# EAGLE design MainBoard (EAGLE 9.3.0)
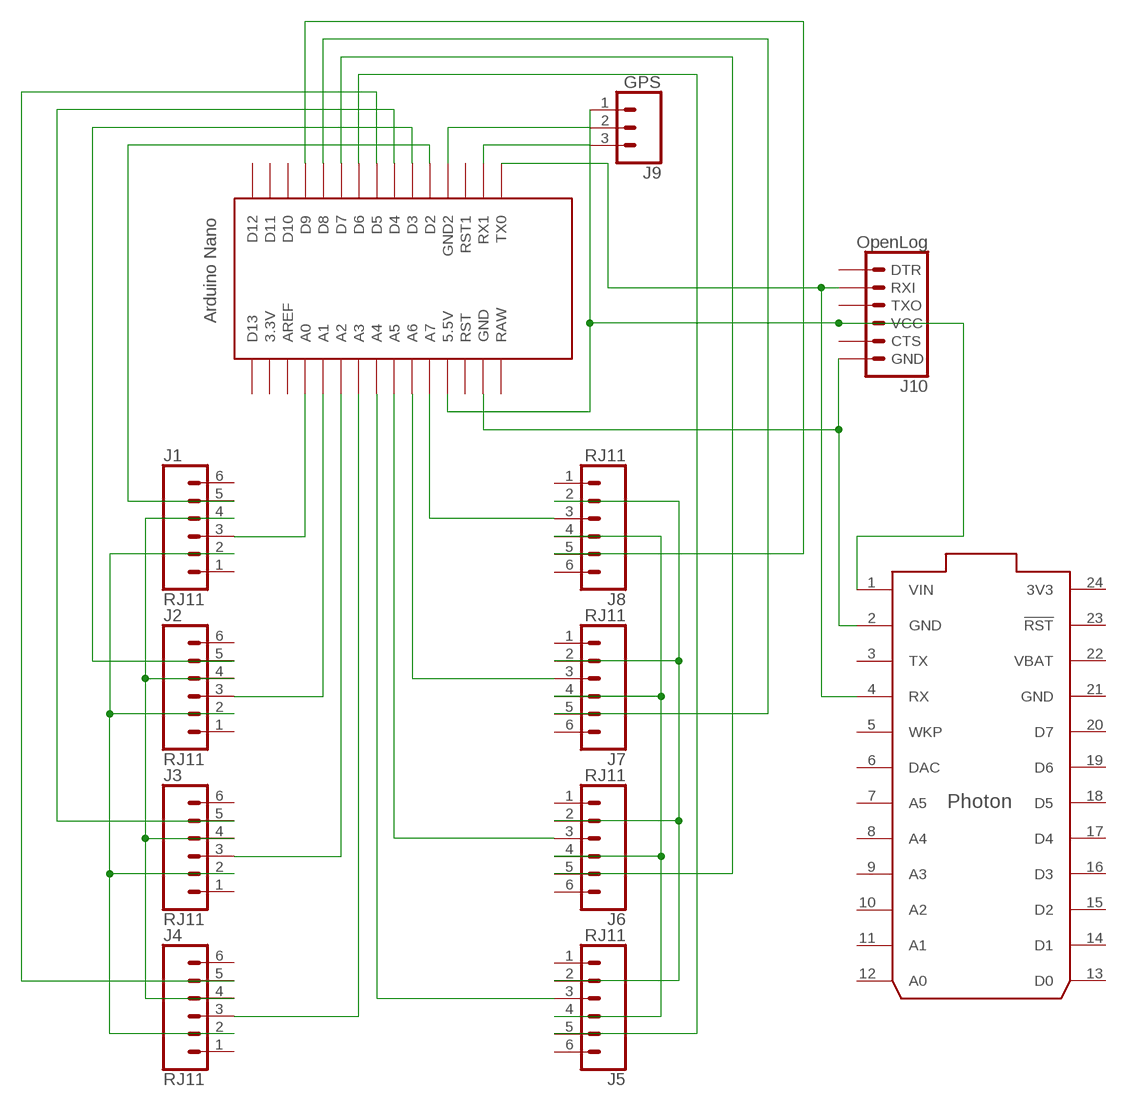
[diagram p0: schematic, sheet 1]

## Parts
J1  RJ11  RJ11-6  [RJ11-6]
J2  RJ11  RJ11-6  [RJ11-6]
J3  RJ11  RJ11-6  [RJ11-6]
J4  RJ11  RJ11-6  [RJ11-6]
J5  RJ11  RJ11-6  [RJ11-6]
J6  RJ11  RJ11-6  [RJ11-6]
J7  RJ11  RJ11-6  [RJ11-6]
J8  RJ11  RJ11-6  [RJ11-6]
J9  GPS  CONN_03  [1X03]
J10  OpenLog  6_PIN_SERIAL_TARGET  [1X06]
U$1  NANO  [NANO]
U$2  PHOTON_WITH_HEADERS  [PHOTON]

## Nets
N$1: J1.2 J2.2 J3.2 J4.2
N$2: J1.3 U$1.A0
N$3: J2.3 U$1.A1
N$4: J5.2 J6.2 J7.2 J8.2
N$5: J1.4 J2.4 J3.4 J4.4
N$6: J5.4 J6.4 J7.4 J8.4
N$7: J3.3 U$1.A2
N$8: J4.3 U$1.A3
N$9: J5.3 U$1.A4
N$10: J6.3 U$1.A5
N$11: J7.3 U$1.A6
N$12: J8.3 U$1.A7
N$13: J1.5 U$1.D2
N$14: J2.5 U$1.D3
N$15: J3.5 U$1.D4
N$16: J4.5 U$1.D5
N$17: J5.5 U$1.D6
N$18: J6.5 U$1.D7
N$19: J7.5 U$1.D8
N$20: J8.5 U$1.D9
N$21: J9.3 U$1.RX1
N$22: J9.2 U$1.GND1(GND2)
N$23: J9.1 J10.4(VCC) U$1.5V(5.5V) U$2.1(VIN)
N$24: J10.6(GND) U$1.GND U$2.2(GND)
N$25: J10.2(RXI) U$1.TX0 U$2.4(RX)
Unconnected: J1.1 J1.6 J2.1 J2.6 J3.1 J3.6 J4.1 J4.6 J5.1 J5.6 J6.1 J6.6 J7.1 J7.6 J8.1 J8.6 J10.1(DTR) J10.3(TXO) J10.5(CTS) U$1.3.3V U$1.AREF U$1.D10 U$1.D11 U$1.D12 U$1.D13 U$1.ICSP1 U$1.ICSP2 U$1.ICSP3 U$1.ICSP4 U$1.ICSP5 U$1.ICSP6 U$1.RAW U$1.RST U$1.RST1 U$2.3(TX) U$2.5(WKP) U$2.6(DAC) U$2.7(A5) U$2.8(A4) U$2.9(A3) U$2.10(A2) U$2.11(A1) U$2.12(A0) U$2.13(D0) U$2.14(D1) U$2.15(D2) U$2.16(D3) U$2.17(D4) U$2.18(D5) U$2.19(D6) U$2.20(D7) U$2.23(!RST)

## Power pins joined to a net without a drawn wire
3V3: U$2.24(3V3)
GND: U$2.21(GND)
VBAT: U$2.22(VBAT)

## Library data of the parts
J1-J8 = SparkFun-Connectors:RJ11-6: RJ11 Jack - 6 pin Commonly found on CAT3 devices and some Microchip programmers. Here is the connector we sell at SparkFun: RJ11 6-Pin Connector <https://www.sparkfun.com/products/132> (PRT-00132) Datasheet <http://www.sparkfun.com/datasheets/Prototyping/Connectors/RJ11-Datasheet.pdf> It is used on this SparkFun product: SparkFun Weather Shield <https://www.sparkfun.com/products/12081> (DEV-12081) Weather Meters <https://www.sparkfun.com/products/8942> (SEN-08942); PROD_ID: CONN-08590; SF_ID: PRT-00132
J9 = SparkFun-Connectors:CONN_03: Multi connection point. Often used as Generic Header-pin footprint for 0.1 inch spaced/style header connections On any of the 0.1 inch spaced packages, you can populate with these: Break Away Headers - Straight <https://www.sparkfun.com/products/116> (PRT-00116) Break Away Male Headers - Right Angle <https://www.sparkfun.com/products/553> (PRT-00553) Female Headers <https://www.sparkfun.com/products/115> (PRT-00115) Break Away Headers - Machine Pin <https://www.sparkfun.com/products/117> (PRT-00117) Break Away Female Headers - Swiss Machine Pin <https://www.sparkfun.com/products/743> (PRT-00743) Stackable Header - 3 Pin (Female, 0.1") <https://www.sparkfun.com/products/13875> (PRT-13875) For SCREWTERMINALS and SPRING TERMINALS visit here: Screw Terimnals on SparkFun.com <https://www.sparkfun.com/search/results?term=Screw+Terminals> (5mm/3.5mm/2.54mm spacing) This device is also useful as a general connection point to wire up your design to another part of your project. Our various solder wires solder well into these plated through hole pads. Hook-Up Wire - Assortment (Stranded, 22 AWG) <https://www.sparkfun.com/products/11375> (PRT-11375) Hook-Up Wire - Assortment (Solid Core, 22 AWG) <https://www.sparkfun.com/products/11367> (PRT-11367) View the entire wire category on our website here <https://www.sparkfun.com/categories/141> Special notes: Molex polarized connector foot print use with SKU : PRT-08232 with associated crimp pins and housings.
J10 = SparkFun-Connectors:6_PIN_SERIAL_TARGET: 6-pin header connection for use with the "FTDI BASIC" pinout - TARGET SIDE. Also known as "Arduino Serial Program Header". It is used to mate with our FTDI Basic serial programmers using the Arduino IDE. Note, this device has "TARGET" in the name. It is intended to be used on a design that contains a target micro-controller that you wish to program. The "sister" device, named "CABLE" is inteneded to be used on a design that usually lives on the end of your USB cable and prvides the converter chip (FTDI232 or FTDI231x) to commnicate serial RX/TX. You can populate with some of these: Break Away Headers - Straight <https://www.sparkfun.com/products/116> (PRT-00116) For reference (or to suit your programming needs) check out these designs: SparkFun FTDI Basic Breakout - 5V <https://www.sparkfun.com/products/9716> (DEV-09716) SparkFun FTDI Basic Breakout - 3.3V <https://www.sparkfun.com/products/9873> (DEV-09873) SparkFun FTDI SmartBasic <https://www.sparkfun.com/products/12935> (DEV-12935) SparkFun Beefy 3 - FTDI Basic Breakout <https://www.sparkfun.com/products/13746> (DEV-13746)
U$1 = Arduino-clone:NANO: Arduino Nano
U$2 = Particle-Devices:PHOTON: Particle Photon Wi-Fi through-hole development board footprint Product datasheet: here <https://docs.particle.io/datasheets/photon-(wifi)/photon-datasheet/> Design files: here <https://github.com/particle-iot/photon> Github : Particle devices library <https://github.com/particle-iot/hardware-libraries/tree/master/Eagle>

## Board
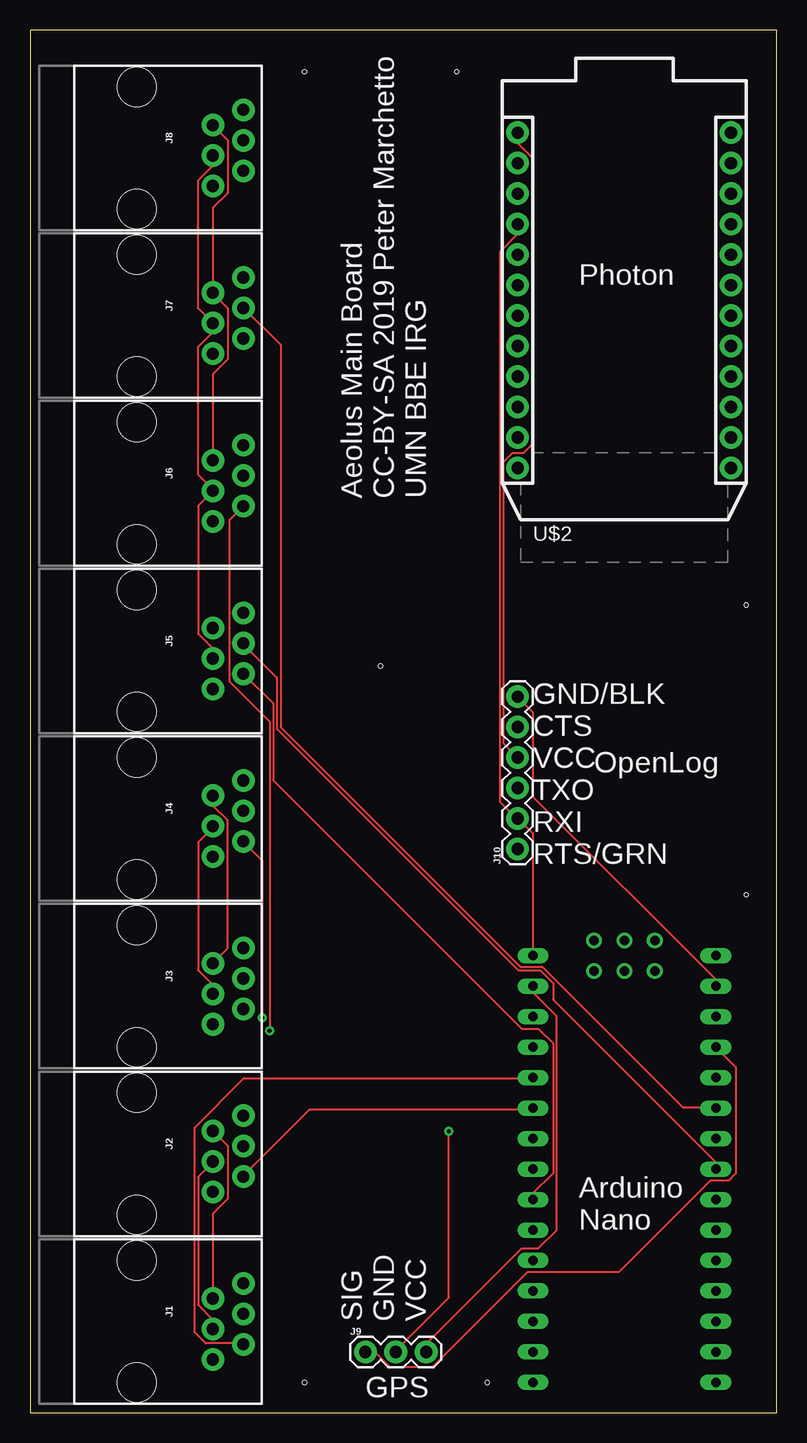
[diagram p1: board, top side]
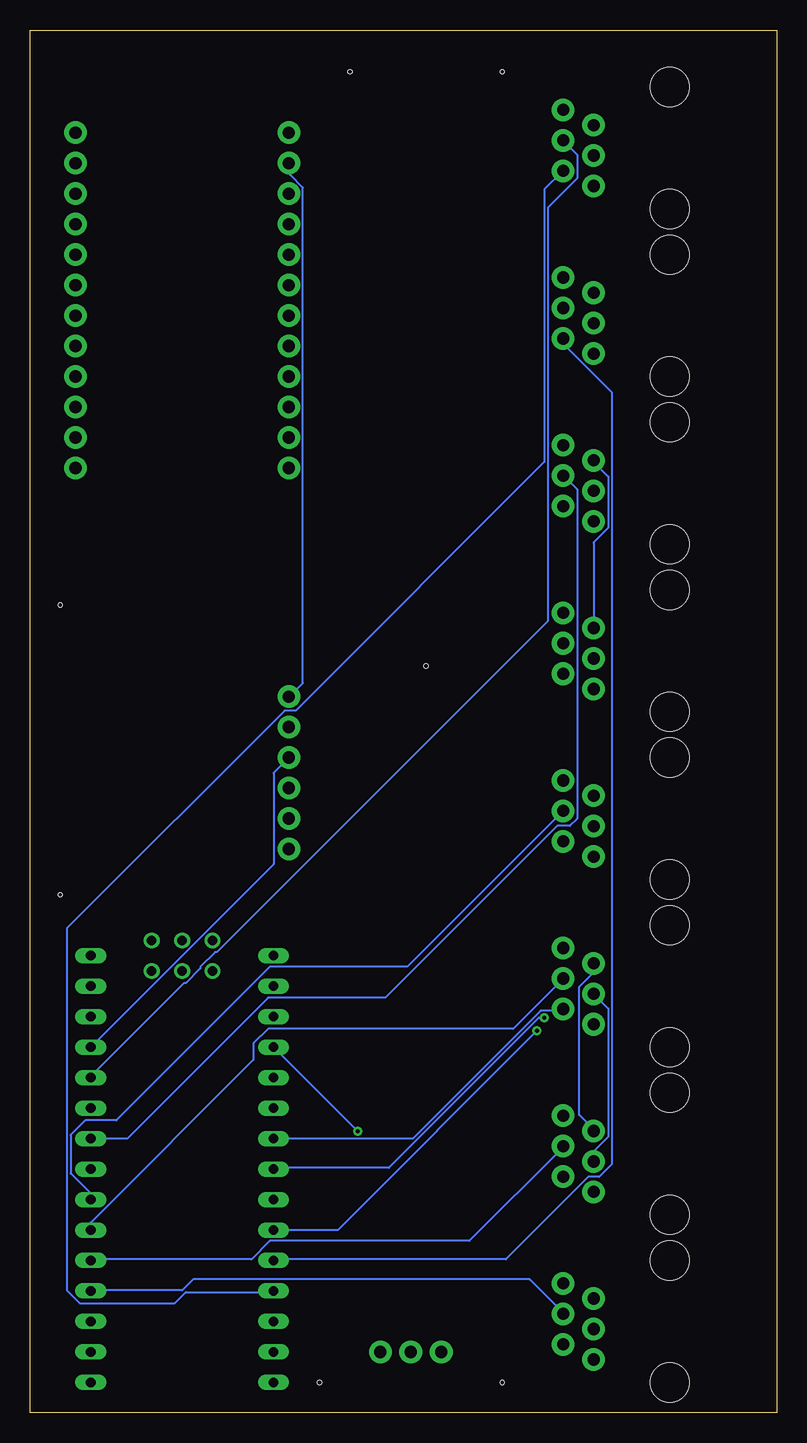
[diagram p2: board, bottom side, seen from below]

Size 62.21 x 115.24 mm. Coordinates in mm from the lower left corner, seen from the top.
Outline: 0,0 62.21,0 62.21,115.24 0,115.24 0,0
Copper layers (1*16): Top 0.035mm / dielectric 1.5mm / Bottom 0.035mm
Design rules "default": minimum track width 6mil, minimum drill 0.35mm, track to track 6mil, track to pad 6mil, pad to pad 6mil, via to via 6mil, smd to smd 6mil, copper to edge 40mil, drill to drill 6mil, minimum pad ring 10mil, minimum via ring 8mil, stop-mask expansion 4mil, vias tented up to drill 0mil, thermal gap 10mil
Holes 0.35 mm at 22.86,2.54 38.1,2.54 59.69,67.31 59.69,43.18 22.86,111.76 35.56,111.76 29.21,62.23

### Footprints (pad centres in the part's own frame; a part is rotated, then mirrored left to right if it is on the bottom)
RJ11-6 = drill 1.016 pad 1.88: 1 -3.175,8.89; 2 -1.905,6.35; 3 -0.635,8.89; 4 0.635,6.35; 5 1.905,8.89; 6 3.175,6.35 | hole 3.251: -5.08,0; 5.08,0
1X03 = drill 1.016 pad 1.88: 1 0,0; 2 2.54,0; 3 5.08,0
1X06 = drill 1.016 pad 1.88: 1 0,0; 2 2.54,0; 3 5.08,0; 4 7.62,0; 5 10.16,0; 6 12.7,0
NANO = drill 0.8 long: 3.3V -10.16,24.13; 5V -10.16,-1.27; A0 -10.16,19.05; A1 -10.16,16.51; A2 -10.16,13.97; A3 -10.16,11.43; A4 -10.16,8.89; A5 -10.16,6.35; A6 -10.16,3.81; A7 -10.16,1.27; AREF -10.16,21.59; D2 5.08,1.27; D3 5.08,3.81; D4 5.08,6.35; D5 5.08,8.89; D6 5.08,11.43; D7 5.08,13.97; D8 5.08,16.51; D9 5.08,19.05; D10 5.08,21.59; D11 5.08,24.13; D12 5.08,26.67; D13 -10.16,26.67; GND -10.16,-6.35; GND1 5.08,-1.27; RAW -10.16,-8.89; RST -10.16,-3.81; RST1 5.08,-3.81; RX1 5.08,-6.35; TX0 5.08,-8.89 | drill 0.8: ICSP1 -5.08,-10.16; ICSP2 -5.08,-7.62; ICSP3 -2.54,-10.16; ICSP4 -2.54,-7.62; ICSP5 0,-10.16; ICSP6 0,-7.62
PHOTON = drill 1.016 pad 1.88: 1 1.27,33.02; 2 1.27,30.48; 3 1.27,27.94; 4 1.27,25.4; 5 1.27,22.86; 6 1.27,20.32; 7 1.27,17.78; 8 1.27,15.24; 9 1.27,12.7; 10 1.27,10.16; 11 1.27,7.62; 12 1.27,5.08; 13 19.05,5.08; 14 19.05,7.62; 15 19.05,10.16; 16 19.05,12.7; 17 19.05,15.24; 18 19.05,17.78; 19 19.05,20.32; 20 19.05,22.86; 21 19.05,25.4; 22 19.05,27.94; 23 19.05,30.48; 24 19.05,33.02

### Placement (x,y rotation side)
J1  8.89,7.62 270 top
J2  8.89,21.59 270 top
J3  8.89,35.56 270 top
J4  8.89,49.53 270 top
J5  8.89,63.5 270 top
J6  8.89,77.47 270 top
J7  8.89,91.44 270 top
J8  8.89,105.41 270 top
J9  27.94,5.08 0 top
J10  40.64,46.99 90 top
U$1  46.99,29.21 180 top
U$2  39.37,73.66 0 top

### Tracks (layer width: path | path; a pad name or v marks a point on that pad's centre or on a via)
N$1
  Top 0.152: J1.2 15.24,16.61 16.46,17.83 16.46,22.25 15.24,23.47 J2.2 | J4.2 15.24,50.6 16.46,49.38 16.46,38.71 15.24,37.49 J3.2
  Bottom 0.152: J3.2 15.24,36.73 16.46,35.51 16.46,24.84 15.24,23.62 J2.2
N$2
  Bottom 0.152: U$1.A0 57.15,10.21 49.53,10.21 48.62,11.12 20.57,11.12 17.83,8.38 J1.3
N$3
  Bottom 0.152: U$1.A1 57.15,12.8 43.74,12.8 42.22,14.33 25.6,14.33 17.83,22.1 J2.3
N$4
  Top 0.152: J8.2 15.24,107.29 16.46,106.07 16.46,101.65 15.24,100.43 J7.2 15.24,93.27 16.46,92.05 16.46,87.78 15.24,86.56 J6.2
  Bottom 0.152: J5.2 15.24,72.54 14.02,73.76 14.02,78.03 15.24,79.25 J6.2
N$5
  Top 0.152: J1.4 15.24,7.77 14.02,8.99 14.02,19.66 15.24,20.88 J2.4 | J3.4 15.24,35.66 14.02,36.88 14.02,47.55 15.24,48.77 J4.4
  Bottom 0.152: J2.4 15.24,21.79 14.02,23.01 14.02,33.68 15.24,34.9 J3.4
N$6
  Top 0.152: J5.4 15.24,63.7 14.02,64.92 14.02,75.59 15.24,76.81 J6.4 15.24,76.96 14.02,78.18 14.02,88.85 15.24,90.07 J7.4 15.24,90.83 14.02,92.05 14.02,102.72 15.24,103.94 J8.4
N$7
  Bottom 0.152: U$1.A2 57.15,15.85 43.59,29.41 43.59,30.79 42.37,32 21.95,32 17.83,36.12 J3.3
N$8
  Bottom 0.152: U$1.A3 57.15,18.29 58.83,19.96 58.83,23.16 57.61,24.38 55.02,24.38 42.22,37.19 30.79,37.19 17.83,50.14 J4.3
N$9
  Top 0.152: U$1.A4 57.15,20.88 43.59,34.44 43.59,35.81 42.52,36.88 40.69,36.88 20.57,57 20.57,61.27 17.83,64.01 J5.3
N$10
  Bottom 0.152: U$1.A5 54.1,22.86 42.37,34.59 32.61,34.59 18.29,48.92 17.22,48.92 16.61,49.53 16.61,76.96 17.68,78.03 J6.3
N$11
  Top 0.152: U$1.A6 57.15,25.45 54.41,25.45 42.67,37.19 40.84,37.19 20.88,57.15 20.88,89 17.83,92.05 J7.3
N$12
  Bottom 0.152: U$1.A7 57.15,28.04 49.38,35.81 49.23,35.81 48.01,37.03 48.01,37.19 46.79,38.41 46.63,38.41 19.05,65.99 19.05,100.43 16.61,102.87 16.61,104.85 17.68,105.92 J8.3
N$13
  Top 0.152: U$1.D2 41.91,27.89 17.83,27.89 13.72,23.77 13.72,6.71 14.63,5.79 17.68,5.79 J1.5
N$14
  Top 0.152: U$1.D3 41.91,25.3 23.32,25.3 17.83,19.81 J2.5
N$15
  Bottom 0.152: U$1.D4 30.33,22.86 19.66,33.53 17.83,33.53 J3.5
N$16  (via drill 0.35)
  Top 0.152: v19.36,32.92 19.36,46.02 17.83,47.55 J4.5
  Bottom 0.152: v19.36,32.92 19.81,32.92 32.31,20.42 41.91,20.42 U$1.D5
N$17
  Top 0.152: U$1.D6 41.91,18.29 43.59,19.96 43.59,30.79 42.37,32 41,32 20.27,52.73 20.27,59.13 17.83,61.57 J5.5
N$18  (via drill 0.35)
  Top 0.152: v19.96,31.85 19.96,57.61 16.61,60.96 16.61,74.37 17.68,75.44 J6.5
  Bottom 0.152: U$1.D7 36.58,15.24 v19.96,31.85
N$19
  Bottom 0.152: U$1.D8 41.91,12.8 22.55,12.8 15.7,19.66 14.78,19.66 13.72,20.73 13.72,85.04 17.68,89 17.68,89.46 J7.5
N$20
  Bottom 0.152: U$1.D9 41.91,10.06 49.23,10.06 50.14,9.14 58.06,9.14 59.13,10.21 59.13,40.39 41,58.52 40.08,58.52 19.36,79.25 19.36,101.96 17.83,103.48 J8.5
N$21
  Top 0.152: U$1.RX1 41.91,35.05 43.89,33.07 43.89,15.24 42.37,13.72 41,13.72 33.07,5.79 33.07,5.18 J9.3
N$22  (via drill 0.35)
  Top 0.152: v34.9,23.47 34.9,9.6 30.48,5.18 J9.2
  Bottom 0.152: v34.9,23.47 U$1.GND1
N$23
  Top 0.152: U$1.5V 58.83,28.8 58.83,19.96 58.22,19.36 56.69,19.36 49.07,11.73 41.45,11.73 33.53,3.81 30.02,3.81 28.8,5.03 28.04,5.03 J9.1 | J10.4 39.47,55.78 39.47,79.25 40.23,80.01 41.15,80.01 41.91,80.77 41.91,104.55 40.69,105.77 40.69,106.68 U$2.1
  Bottom 0.152: U$1.5V 41.91,45.72 41.91,53.34 J10.4
N$24
  Top 0.152: U$1.GND 57.15,36.12 41.91,51.36 41.91,58.37 40.69,59.59 J10.6
  Bottom 0.152: U$2.2 40.54,104.09 40.54,103.17 39.47,102.11 39.47,60.81 40.54,59.74 J10.6
N$25
  Top 0.152: U$1.TX0 41.91,48.31 40.69,49.53 J10.2 40.54,49.53 39.17,50.9 39.17,96.77 40.54,98.15 40.54,99.06 U$2.4

### Text on the board
_tsilk: Photon | Aeolus Main Board / CC-BY-SA 2019 Peter Marchetto / UMN BBE IRG | OpenLog | GND/BLK / CTS / VCC / TXO / RXI / RTS/GRN | Arduino / Nano | SIG / GND / VCC | GPS